# EAGLE design ssslidar_v0.1_middle_plate (EAGLE 7.6.0)
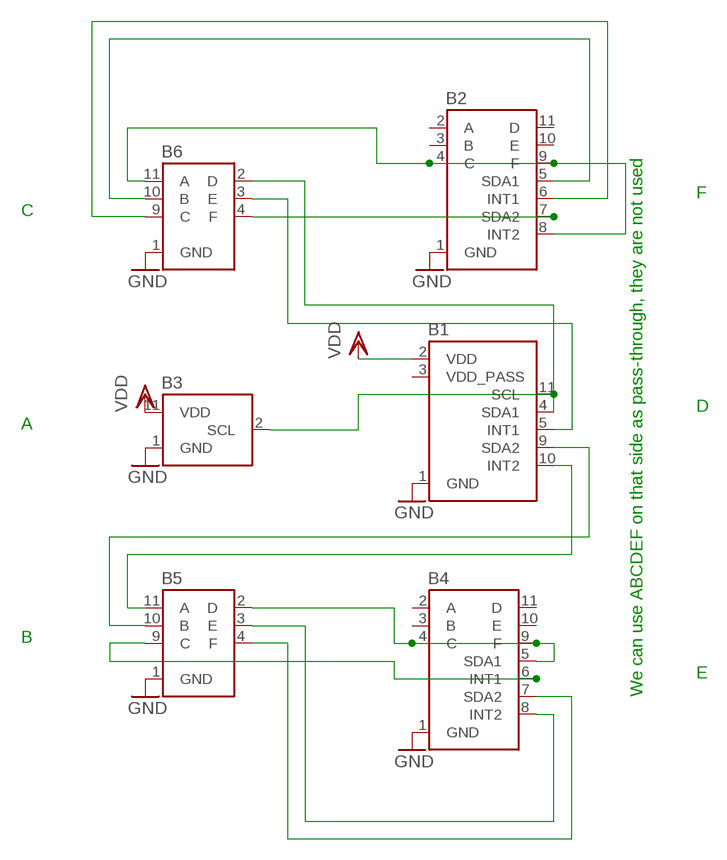
[diagram p0: schematic, sheet 1]

## Parts
B1  BLADE_PWR_BOTTOM  [BLADE]
B2  BLADE_SIG_BOTTOM  [BLADE]
B3  BLADE_PWR_TOP  [BLADE]
B4  BLADE_SIG_BOTTOM  [BLADE]
B5  BLADE_SIG_TOP  [BLADE]
B6  BLADE_SIG_TOP  [BLADE]

## Nets
GND: B1.1(GND) B2.1(GND) B3.1(GND) B4.1(GND) B5.1(GND) B6.1(GND)
N$1: B1.11(SCL) B3.2(SCL)
N$2: B2.4(C) B2.8(INT2) B2.9(F) B6.11(A)
N$3: B2.5(SDA1) B6.10(B)
N$4: B2.6(INT1) B6.9(C)
N$6: B1.5(INT1) B6.3(E)
N$7: B2.7(SDA2) B6.4(F)
N$8: B4.8(INT2) B5.3(E)
N$10: B4.4(C) B4.5(SDA1) B4.9(F) B5.2(D)
N$11: B4.6(INT1) B5.9(C)
N$12: B1.9(SDA2) B5.10(B)
N$13: B1.10(INT2) B5.11(A)
N$14: B1.4(SDA1) B6.2(D)
N$21: B4.7(SDA2) B5.4(F)
VDD: B1.2(VDD) B3.11(VDD)
Unconnected: B1.3(VDD_PASS) B2.2(A) B2.3(B) B2.10(E) B2.11(D) B4.2(A) B4.3(B) B4.10(E) B4.11(D)

## Notes on the sheet
- F
- C
- D
- A
- B
- E
- We can use ABCDEF on that side as pass-through, they are not used

## Library data of the parts
B1 = ssslidar:BLADE_PWR_BOTTOM
B2 B4 = ssslidar:BLADE_SIG_BOTTOM
B3 = ssslidar:BLADE_PWR_TOP
B5 B6 = ssslidar:BLADE_SIG_TOP

## Board
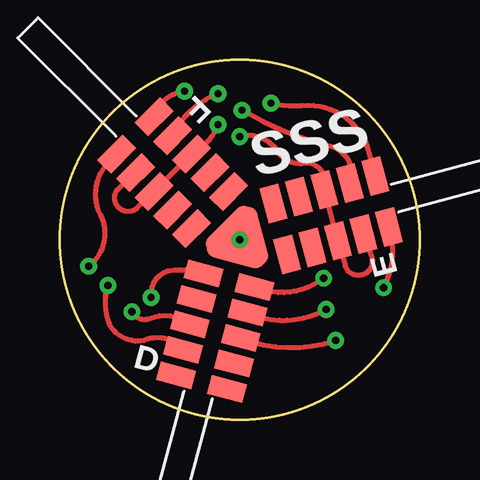
[diagram p1: board, top side]
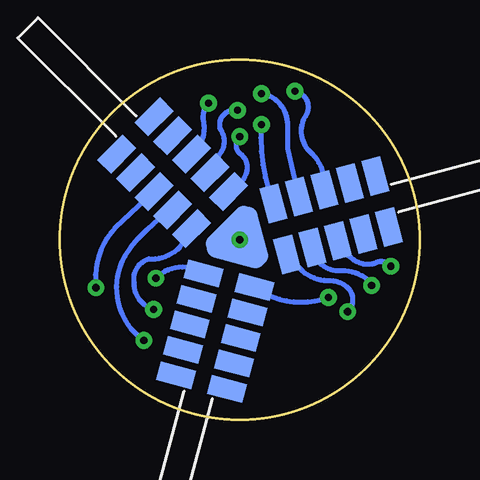
[diagram p2: board, bottom side, seen from below]

Size 15 x 15 mm. Coordinates in mm from the lower left corner, seen from the top.
Outline: circle at 7.5,7.5 radius 7.5
Copper layers (1*2*3*16): Top 0.035mm / dielectric 0.15mm / Route2 0.035mm / dielectric 1.1mm / Route3 0.035mm / dielectric 0.15mm / Bottom 0.035mm
Design rules "Xevelabs_6mil_4layers_eurocircuits *": minimum track width 0.15mm, minimum drill 0.25mm, track to track 0.155mm, track to pad 0.155mm, pad to pad 0.155mm, via to via 0.155mm, smd to smd 0mil, copper to edge 0.25mm, drill to drill 0.25mm, minimum pad ring 0.15mm, minimum via ring 0.2mm, stop-mask expansion 0mil, vias tented up to drill 100mil, thermal gap 0.2mm

### Footprints (pad centres in the part's own frame; a part is rotated, then mirrored left to right if it is on the bottom)
BLADE = smd 1 x 2.5: 1 0.5,0 | smd 0.8 x 1.5: 2 1.75,-1.1; 3 2.85,-1.1; 4 3.95,-1.1; 5 5.05,-1.1; 6 6.15,-1.1; 7 6.15,1.1; 8 5.05,1.1; 9 3.95,1.1; 10 2.85,1.1; 11 1.75,1.1

### Placement (x,y rotation side)
B1  7.5,7.5 255 top
B2  7.5,7.5 135 top
B3  7.5,7.5 255 bottom
B4  7.5,7.5 15 top
B5  7.5,7.5 135 bottom
B6  7.5,7.5 15 bottom

### Tracks (layer width: path | path; a pad name or v marks a point on that pad's centre or on a via)
GND  (via drill 0.3)
  Top 0.2: 7.63,7.85 B2.1 7.5,7.85 v7.5,7.5 | 7.63,7.85 B5.1 7.85,7.63 B4.1 | 7.63,7.85 B3.1 B1.1
  Bottom 0.2: B6.1 7.15,7.63 B2.1 7.63,7.85 | 7.63,7.85 B3.1 | 7.63,7.85 B5.1 7.5,7.85 v7.5,7.5
N$1  (via drill 0.3)
  Top 0.2: v11,5.9 arc-61 B1.11
  Bottom 0.2: B3.2 arc-78 v11,5.9
N$2  (via drill 0.3)
  Top 0.2: v6.6,12.3 arc-43 B2.4 B2.9 3.2,8.8 arc-166 2.4,9.6 B2.8
  Bottom 0.2: v6.6,12.3 arc-26 B6.11
N$3  (via drill 0.3)
  Top 0.2: v6.6,13.6 arc42 B2.5
  Bottom 0.2: B6.10 5.5,11.3 5.5,12.3 arc-80 v6.6,13.6
N$4  (via drill 0.3)
  Top 0.2: B2.6 arc-68 v5.2,13.7
  Bottom 0.2: v5.2,13.7 arc119 4.8,12.6 arc-78 4.5,11.1 arc51 B6.9
N$6  (via drill 0.3)
  Top 0.2: B1.5 arc74 3.5,3.3 arc-68 2.1,3.9 arc-39 v2,5.6
  Bottom 0.2: v2,5.6 arc-37 2.4,6 arc-32 3.4,6.2 arc81 B6.3
N$7  (via drill 0.3)
  Top 0.2: B2.7 2.1,10.8 arc69 1.6,8.7 arc-85 v1.2,6.4
  Bottom 0.2: v1.2,6.4 arc-85 1.9,6.5 arc62 2.9,6.8 arc66 B6.4
N$8  (via drill 0.3)
  Top 0.2: v7.6,12.9 arc16 11.3,11.4 arc-94 B4.8
  Bottom 0.2: B5.3 8.4,11 arc-82 8.3,12.1 arc121 v7.6,12.9
N$10  (via drill 0.3)
  Top 0.2: B4.5 13,6.8 arc-180 11.9,6.4 B4.4 B4.9 arc108 10.3,10.7 arc-76 9,11.3 arc66 v7.5,11.8
  Bottom 0.2: v7.5,11.8 arc-95 7.5,11.1 arc67 7.2,10.4 arc60 B5.2
N$11  (via drill 0.3)
  Top 0.2: v13.5,5.5 arc46 B4.6
  Bottom 0.2: B5.9 12.7,8 arc-48 v13.5,5.5
N$12  (via drill 0.3)
  Top 0.2: B1.9 arc40 v11.5,3.3
  Bottom 0.2: v11.5,3.3 arc47 12.6,5.1 arc37 12.3,6.8 arc28 B5.10
N$13  (via drill 0.3)
  Top 0.2: B1.10 arc54 v11.1,4.6
  Bottom 0.2: v11.1,4.6 arc76 11.9,5.7 arc84 11.3,6.7 arc-51 10,7.2 B5.11
N$14  (via drill 0.3)
  Top 0.2: v3,4.5 arc80 3.7,4.2 4,4.3 arc-52 B1.4
  Bottom 0.2: B6.2 5,6.3 arc-49 3.7,5.8 arc39 3,5.5 arc90 v3,4.5
N$21  (via drill 0.3)
  Top 0.2: v8.8,13.2 arc19 10.1,13.1 arc-76 12.8,11.4 B4.7
  Bottom 0.2: B5.4 arc-64 9,12.4 arc55 v8.8,13.2
VDD  (via drill 0.3)
  Top 0.2: v3.8,5.1 arc-77 4.5,6.2 arc-29 B1.2
  Bottom 0.2: B3.11 arc-56 v3.8,5.1

### Text on the board
tPlace: F | SSS | E | D